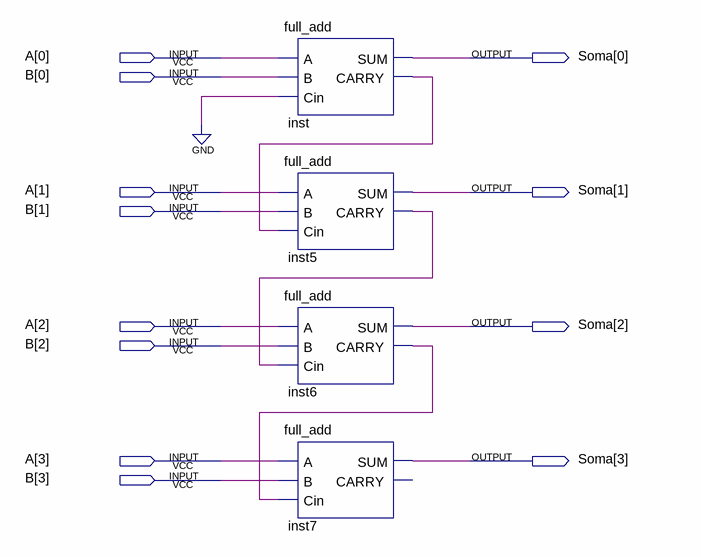
[diagram p0: schematic sheet]
// Quartus schematic add4.bdf as structural Verilog: 4 symbols, 12 pins
module add4 (
  input  [3:0] A,
  input  [3:0] B,
  output [3:0] Soma
);

  wire inst5_carry, inst6_carry, inst_carry;

  full_add inst (.A(A[0]), .B(B[0]), .Cin(1'b0), .SUM(Soma[0]), .CARRY(inst_carry));
  full_add inst5 (.A(A[1]), .B(B[1]), .Cin(inst_carry), .SUM(Soma[1]), .CARRY(inst5_carry));
  full_add inst6 (.A(A[2]), .B(B[2]), .Cin(inst5_carry), .SUM(Soma[2]), .CARRY(inst6_carry));
  full_add inst7 (.A(A[3]), .B(B[3]), .Cin(inst6_carry), .SUM(Soma[3]));  // open: CARRY
endmodule
